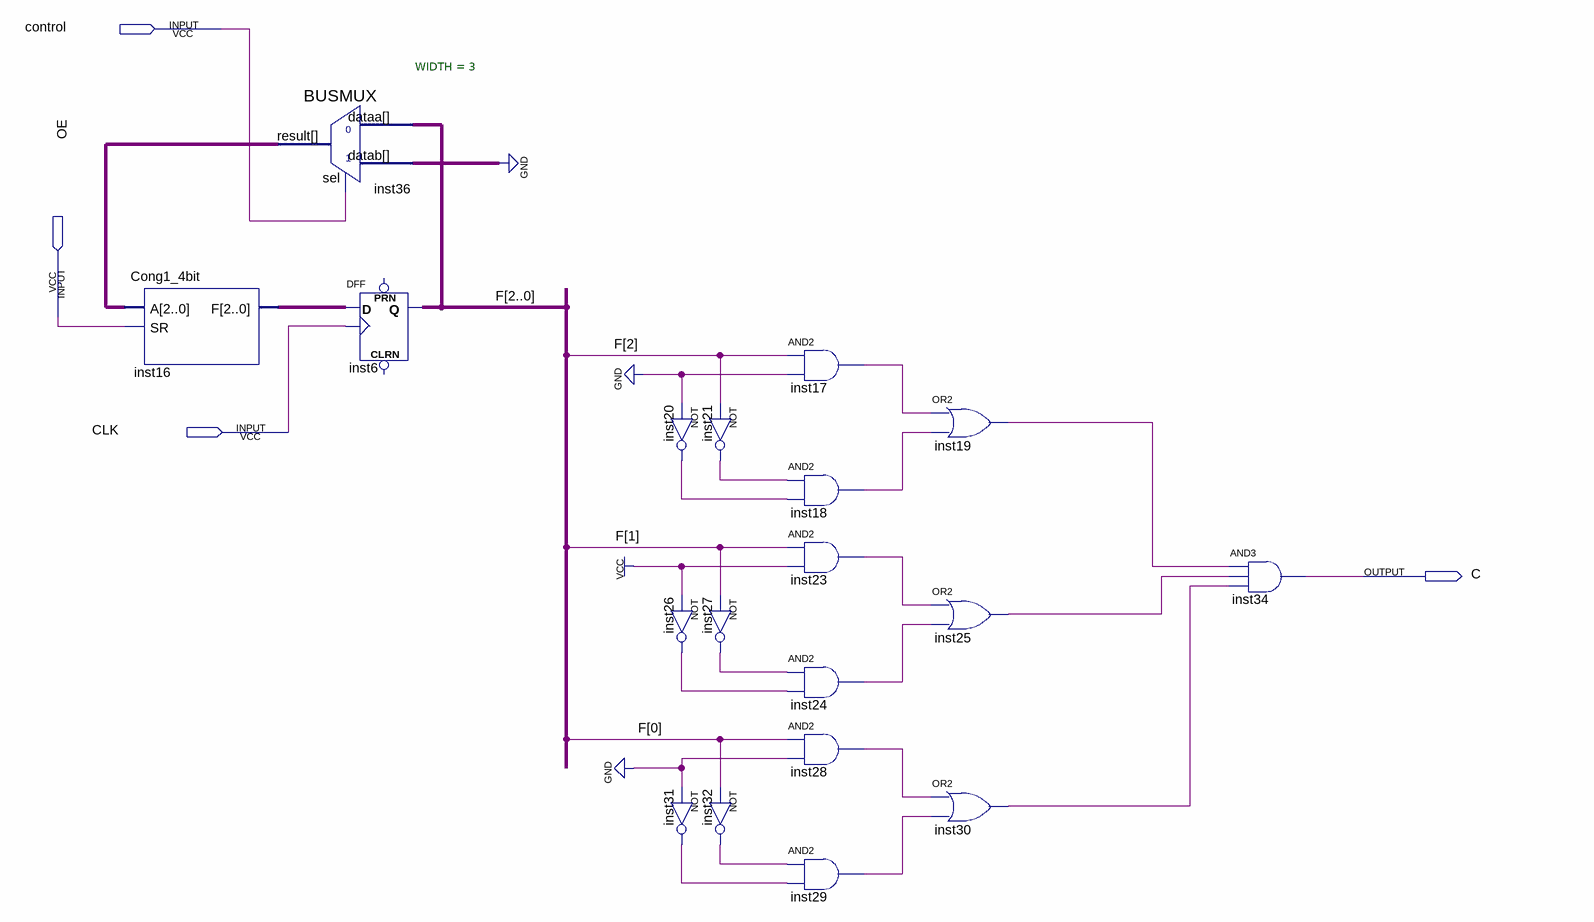
[diagram p0: schematic sheet]
// Quartus schematic CMP.bdf as structural Verilog: 19 symbols, 4 pins
module CMP (
  input  control,
  input  OE,
  input  CLK,
  output C
);

  wire inst17_out, inst18_out, inst19_out, inst20_out, inst21_out, inst23_out, inst24_out, inst25_out,
       inst26_out, inst27_out, inst28_out, inst29_out, inst30_out, inst31_out, inst32_out;
  wire [2:0] F, inst16_f, inst36_result;

  Cong1_4bit inst16 (.A(inst36_result), .SR(OE), .F(inst16_f));
  BUSMUX #(.WIDTH(3)) inst36 (.dataa(F), .datab(3'b000), .sel(control), .result(inst36_result));
  DFF inst6[2:0] (.CLK(CLK), .D(inst16_f), .Q(F));  // open: CLRN, PRN
  not inst20 (inst20_out, 1'b0);
  not inst26 (inst26_out, 1'b1);
  not inst31 (inst31_out, 1'b0);
  not inst21 (inst21_out, F[2]);
  not inst27 (inst27_out, F[1]);
  not inst32 (inst32_out, F[0]);
  and inst17 (inst17_out, F[2], 1'b0);
  and inst18 (inst18_out, inst21_out, inst20_out);
  and inst23 (inst23_out, F[1], 1'b1);
  and inst24 (inst24_out, inst27_out, inst26_out);
  and inst28 (inst28_out, F[0], 1'b0);
  and inst29 (inst29_out, inst32_out, inst31_out);
  or inst19 (inst19_out, inst17_out, inst18_out);
  or inst25 (inst25_out, inst23_out, inst24_out);
  or inst30 (inst30_out, inst28_out, inst29_out);
  and inst34 (C, inst19_out, inst25_out, inst30_out);
endmodule
